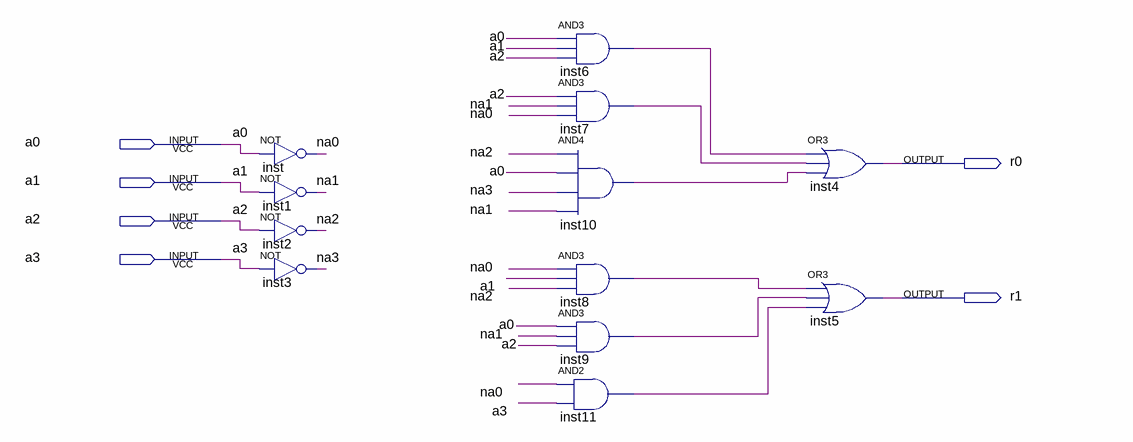
[diagram p0: schematic sheet]
// Quartus schematic modulo3.bdf as structural Verilog: 12 symbols, 6 pins
module modulo3 (
  input  a0,
  input  a1,
  input  a2,
  input  a3,
  output r0,
  output r1
);

  wire inst6_out, inst7_out, inst8_out, inst9_out, inst10_out, inst11_out, na0, na1, na2, na3;

  not inst (na0, a0);
  not inst1 (na1, a1);
  not inst2 (na2, a2);
  not inst3 (na3, a3);
  and inst6 (inst6_out, a0, a1, a2);
  and inst7 (inst7_out, a2, na1, na0);
  and inst10 (inst10_out, na2, a0, na3, na1);
  and inst8 (inst8_out, na0, a1, na2);
  and inst9 (inst9_out, a0, na1, a2);
  and inst11 (inst11_out, na0, a3);
  or inst4 (r0, inst6_out, inst7_out, inst10_out);
  or inst5 (r1, inst8_out, inst9_out, inst11_out);
endmodule
